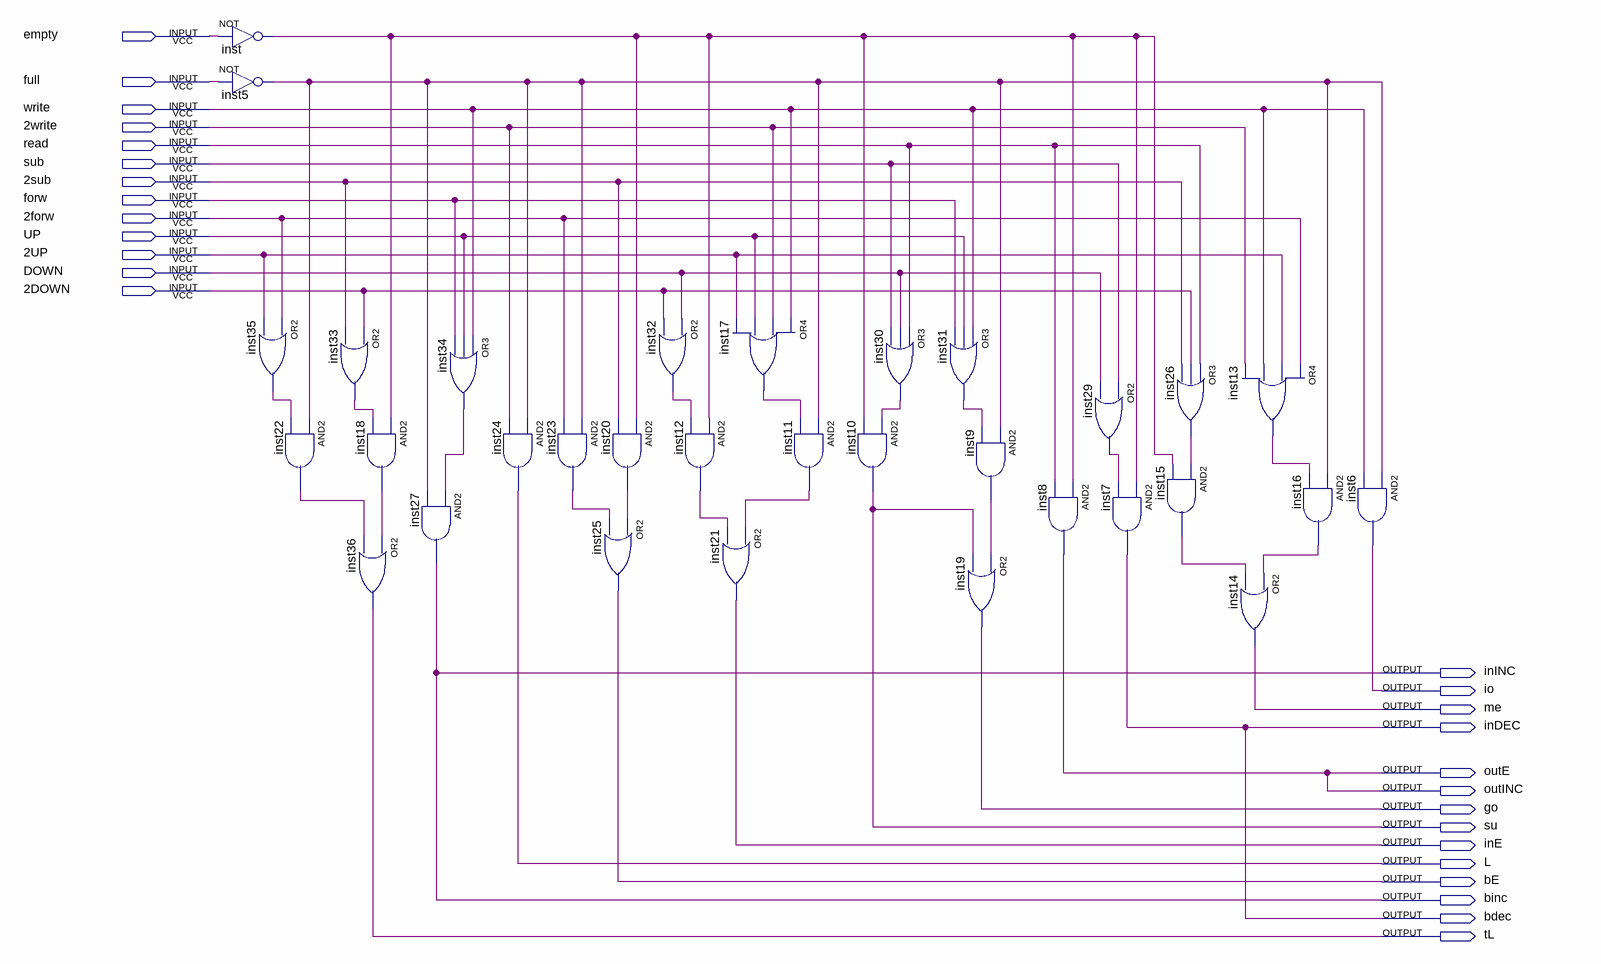
[diagram p0: schematic sheet]
// Quartus schematic inctr.bdf as structural Verilog: 32 symbols, 27 pins
module inctr (
  input  empty,
  input  full,
  input  write,
  input  \2write ,
  input  read,
  input  sub,
  input  \2sub ,
  input  forw,
  input  \2forw ,
  input  UP,
  input  \2UP ,
  input  DOWN,
  input  \2DOWN ,
  output inINC,
  output io,
  output me,
  output inDEC,
  output outE,
  output outINC,
  output go,
  output su,
  output inE,
  output L,
  output bE,
  output binc,
  output bdec,
  output tL
);

  wire inst5_out, inst9_out, inst11_out, inst12_out, inst13_out, inst15_out, inst16_out, inst17_out,
       inst18_out, inst20_out, inst22_out, inst23_out, inst26_out, inst29_out, inst30_out, inst31_out,
       inst32_out, inst33_out, inst34_out, inst35_out, inst_out;

  not inst (inst_out, empty);
  not inst5 (inst5_out, full);
  or inst35 (inst35_out, \2forw , \2UP );
  or inst33 (inst33_out, \2DOWN , \2sub );
  and inst22 (inst22_out, inst5_out, inst35_out);
  and inst18 (inst18_out, inst_out, inst33_out);
  or inst36 (tL, inst18_out, inst22_out);
  or inst34 (inst34_out, write, UP, forw);
  and inst27 (binc, inst34_out, inst5_out);
  and inst24 (L, inst5_out, \2write );
  and inst23 (inst23_out, inst5_out, \2forw );
  and inst20 (inst20_out, inst_out, \2sub );
  or inst25 (bE, inst20_out, inst23_out);
  or inst32 (inst32_out, DOWN, \2DOWN );
  and inst12 (inst12_out, inst_out, inst32_out);
  or inst17 (inst17_out, write, \2write , UP, \2UP );
  or inst21 (inE, inst11_out, inst12_out);
  and inst11 (inst11_out, inst5_out, inst17_out);
  or inst30 (inst30_out, read, DOWN, sub);
  and inst10 (su, inst30_out, inst_out);
  or inst31 (inst31_out, write, UP, forw);
  and inst9 (inst9_out, inst5_out, inst31_out);
  or inst19 (go, inst9_out, su);
  and inst8 (outE, inst_out, read);
  or inst29 (inst29_out, sub, DOWN);
  and inst7 (bdec, inst_out, inst29_out);
  or inst26 (inst26_out, read, \2DOWN , \2sub );
  and inst15 (inst15_out, inst26_out, inst_out);
  or inst13 (inst13_out, \2forw , \2UP , write, \2write );
  or inst14 (me, inst16_out, inst15_out);
  and inst6 (io, inst5_out, write);
  and inst16 (inst16_out, inst5_out, inst13_out);

  assign inDEC = bdec;
  assign inINC = binc;
  assign outINC = outE;
endmodule
